# EAGLE design Smart ezNODE 503 M2 (EAGLE 7.7.0)
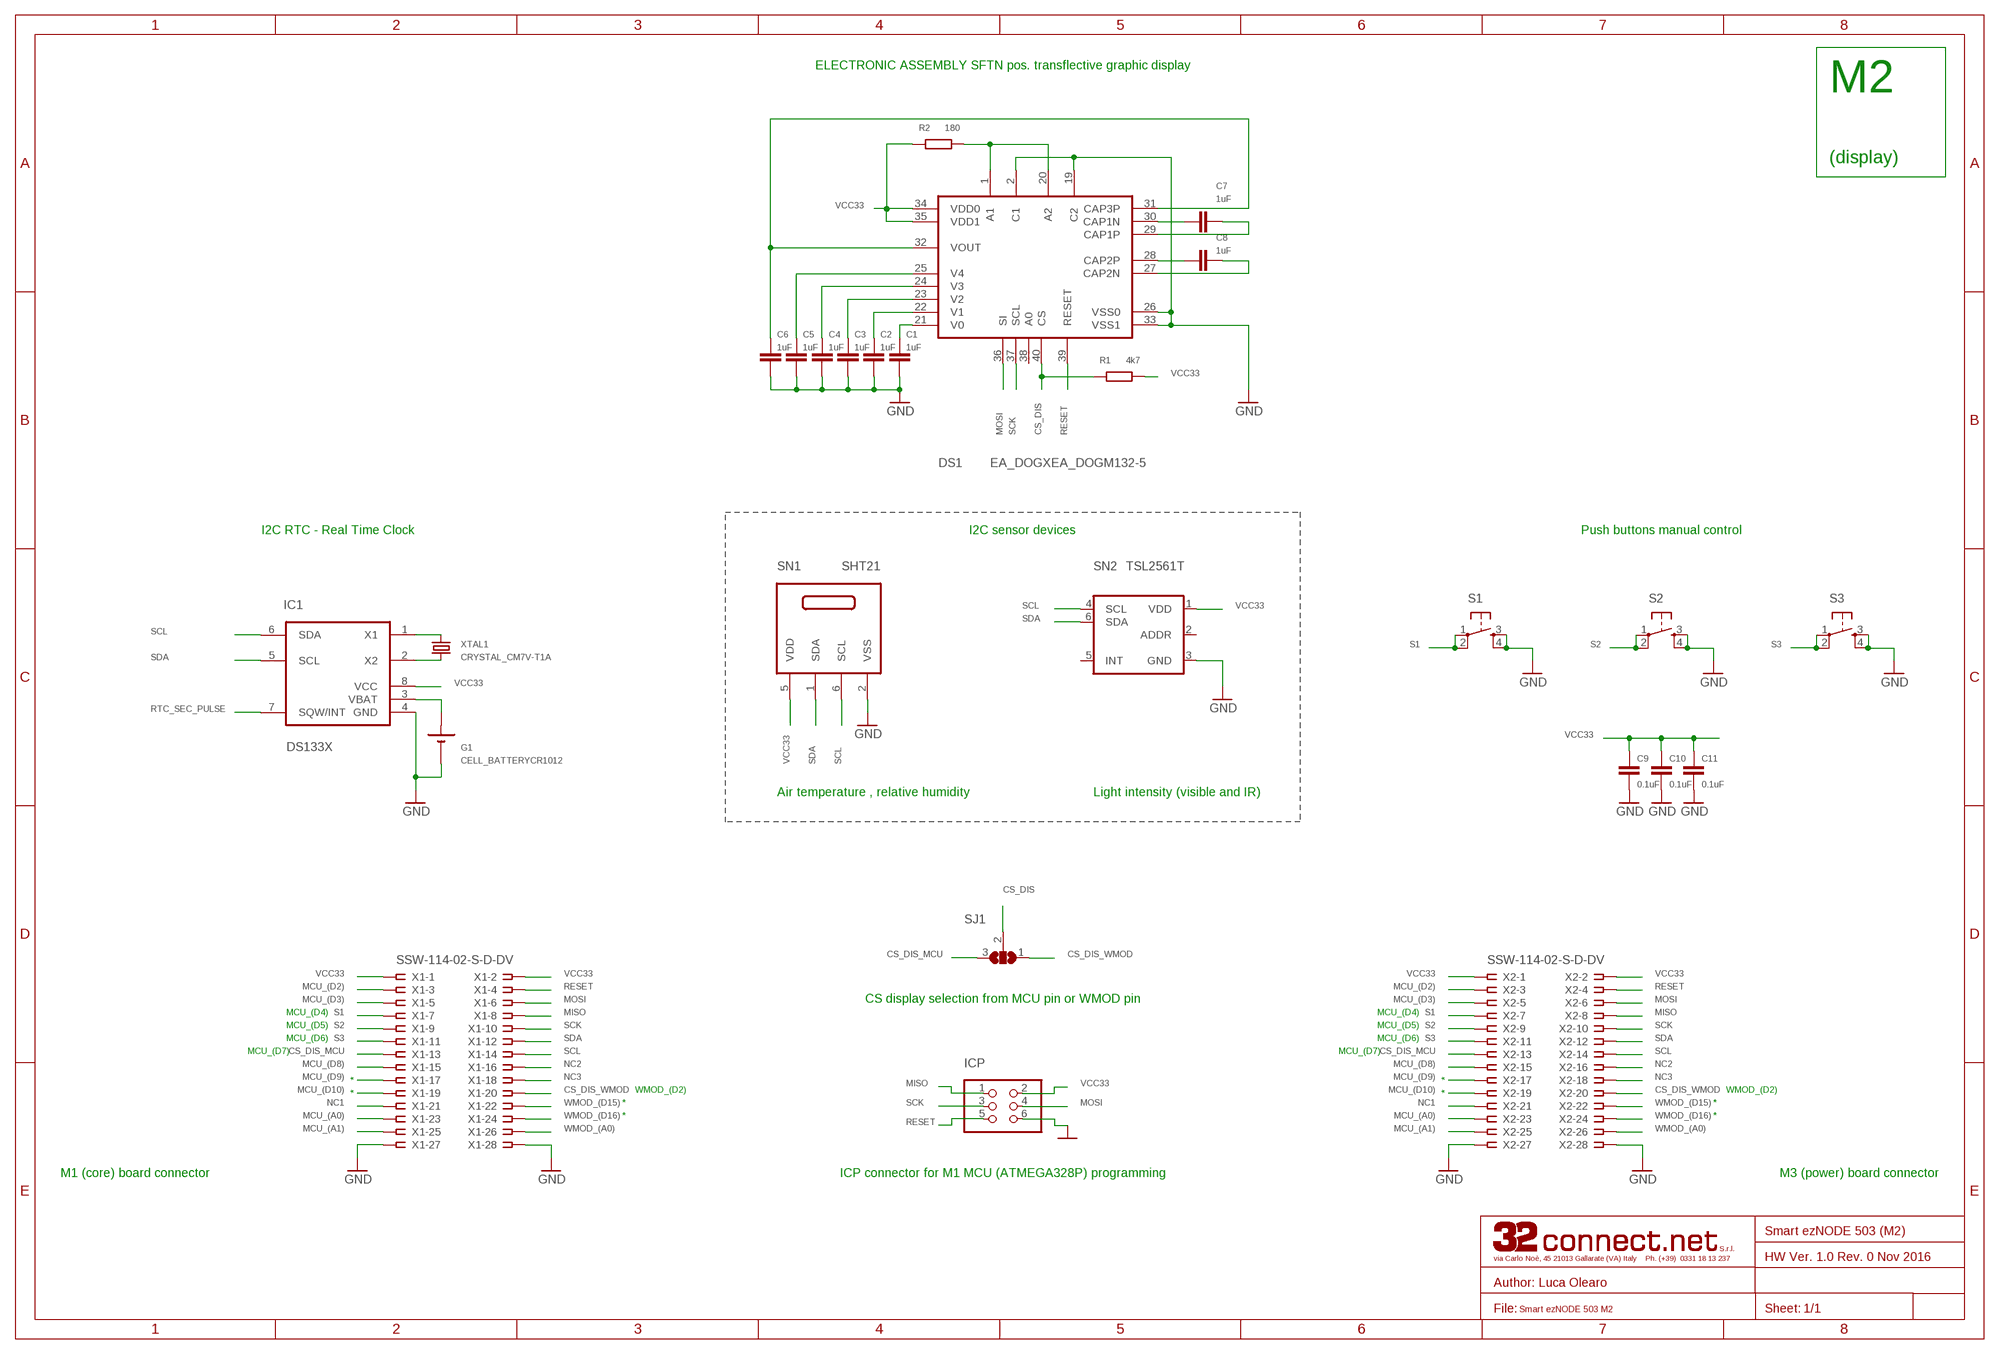
[diagram p0: schematic, sheet 1]

## Parts
C1  1uF  C-EUC0402  [C0402]
C2  1uF  C-EUC0402  [C0402]
C3  1uF  C-EUC0402  [C0402]
C4  1uF  C-EUC0402  [C0402]
C5  1uF  C-EUC0402  [C0402]
C6  1uF  C-EUC0402  [C0402]
C7  1uF  C-EUC0402  [C0402]
C8  1uF  C-EUC0402  [C0402]
C9  0.1uF  C-EUC0402  [C0402]
C10  0.1uF  C-EUC0402  [C0402]
C11  0.1uF  C-EUC0402  [C0402]
DS1  EA_DOGXEA_DOGM132-5  [EA_DOGM]
G1  CELL_BATTERYCR1012  [12MM_SMD_COIN_CELL_BATTERY_HOLDER]
IC1  DS133X  [MICRO08]
ICP  PINHD-2X3/SMD  [2X3_SMD]
R1  4k7  R-EU_R0402  [R0402]
R2  180  R-EU_R0805  [R0805]
S1  TAC_SWITCH3  [C&KKSCX_BEND]
S2  TAC_SWITCH3  [C&KKSCX_BEND]
S3  TAC_SWITCH3  [C&KKSCX_BEND]
SJ1  SJ2W  [SJ_2]
SN1  SHT21  [DFN6/SHT]
SN2  TSL2561T  [TMB-6]
X1  SSW-114-02-S-D-DV  [CLE-114-01-X-DV-A]
X2  SSW-114-02-S-D-DV  [CLE-114-01-X-DV-A]
XTAL1  CRYSTAL_CM7V-T1A  [CRYSTAL_CM7V-T1A]

## Nets
CS_DIS: DS1.40(CS) R1.1 SJ1.2
CS_DIS_MCU: SJ1.3 X1.13 X2.13
CS_DIS_WMOD: SJ1.1 X1.20 X2.20
GND: C1.2 C2.2 C3.2 C4.2 C5.2 C6.2 C9.2 C10.2 C11.2 DS1.2(C1) DS1.19(C2) DS1.26(VSS0) DS1.33(VSS1) G1.P$2(-) IC1.4(GND) ICP.6 S1.3 S1.4 S2.3 S2.4 S3.3 S3.4 SN1.2(VSS) SN2.3(GND) X1.27 X1.28 X2.27 X2.28
MCU_(A0): X1.23 X2.23
MCU_(A1): X1.25 X2.25
MCU_(D2): X1.3 X2.3
MCU_(D3): X1.5 X2.5
MCU_(D8): X1.15 X2.15
MCU_(D9): X1.17 X2.17
MCU_(D10): X1.19 X2.19
MISO: ICP.1 X1.8 X2.8
MOSI: DS1.36(SI) ICP.4 X1.6 X2.6
N$2: IC1.1(X1) XTAL1.P$2
N$3: IC1.2(X2) XTAL1.P$1
N$5: DS1.1(A1) DS1.20(A2) R2.1
N$8: C1.1 DS1.21(V0)
N$9: C7.1 DS1.30(CAP1N)
N$10: C2.1 DS1.22(V1)
N$11: C3.1 DS1.23(V2)
N$12: C4.1 DS1.24(V3)
N$13: C5.1 DS1.25(V4)
N$14: C6.1 DS1.31(CAP3P) DS1.32(VOUT)
N$15: C7.2 DS1.29(CAP1P)
N$16: C8.1 DS1.28(CAP2P)
N$17: C8.2 DS1.27(CAP2N)
N$18: G1.P$1(+) IC1.3(VBAT)
NC1: X1.21 X2.21
NC2: X1.16 X2.16
NC3: X1.18 X2.18
RESET: DS1.39(RESET) ICP.5 X1.4 X2.4
RTC_SEC_PULSE: IC1.7(SQW/INT)
S1: S1.1 S1.2 X1.7 X2.7
S2: S2.1 S2.2 X1.9 X2.9
S3: S3.1 S3.2 X1.11 X2.11
SCK: DS1.37(SCL) ICP.3 X1.10 X2.10
SCL: IC1.5(SCL) SN1.6(SCL) SN2.4(SCL) X1.14 X2.14
SDA: IC1.6(SDA) SN1.1(SDA) SN2.6(SDA) X1.12 X2.12
VCC33 [VCC1]: C9.1 C10.1 C11.1 DS1.34(VDD0) DS1.35(VDD1) IC1.8(VCC) ICP.2 R1.2 R2.2 SN1.5(VDD) SN2.1(VDD) X1.1 X1.2 X2.1 X2.2
WMOD_(A0): X1.26 X2.26
WMOD_(D15): X1.22 X2.22
WMOD_(D16): X1.24 X2.24
Unconnected: DS1.38(A0) SN2.2(ADDR) SN2.5(INT)

## Notes on the sheet
- ELECTRONIC ASSEMBLY SFTN pos. transflective graphic display
- M2
- (display)
- I2C RTC - Real Time Clock | I2C sensor devices | Push buttons manual control
- Air temperature , relative humidity | Light intensity (visible and IR)
- CS display selection from MCU pin or WMOD pin
- MCU_(D4) | MCU_(D4)
- MCU_(D5) | MCU_(D5)
- MCU_(D6) | MCU_(D6)
- MCU_(D7) | MCU_(D7)
- * | *
- * | WMOD_(D2) | * | WMOD_(D2)
- * | *
- * | *
- M1 (core) board connector | ICP connector for M1 MCU (ATMEGA328P) programming | M3 (power) board connector
- Smart ezNODE 503 (M2)
- HW Ver. 1.0 Rev. 0 Nov 2016

## Library data of the parts
C1-C11 = rcl:C-EU: CAPACITOR, European symbol
DS1 = ea:EA_DOGX
G1 = Multiconnect_base:CELL_BATTERY: CELL BATTERY
IC1 = Multiconnect_base:DS133X
ICP = Multiconnect_base:PINHD-2X3: PIN HEADER
R1 R2 = rcl:R-EU_: RESISTOR, European symbol
S1-S3 = Multiconnect_base:TAC_SWITCH: Momentary Switch
SJ1 = Multiconnect_base:SJ2W: SMD solder JUMPER
SN1 = sensirion:SHT21: Humidity and Temperature Sensor
SN2 = Multiconnect_base:TSL2561: TSL2561 illumination sensor Approximates Human Eye Response Precisely Measures Illuminance Programmable Interrupt Function with User-Defined Upper and Lower Threshold 400 KHz I2C interface Programmable Analog Gain and Integration Time Supporting 1,000,000-to-1 Dynamic Range Automatically Rejects 50/60-Hz Lighting Ripple Low Active Power (0.75 mW Typical) with Power Down Mode RoHS Compliant The TSL2561 is a light-to-digital converter that transform light intensity to a digital signal output via I2C interface. The device combines one broadband photodiode (visible plus infrared) and one infrared-responding photodiode on a single CMOS integrated circuit capable of providing a near-photopic response over an effective 20-bit dynamic range (16-bit resolution). Two integrating ADCs convert the photodiode currents to a digital output that represents the irradiance measured on each channel. This digital output can be input to a microprocessor where illuminance (ambient light level) in lux is derived using an empirical formula to approximate the human eye response. The TSL2561 device supports a traditional level style interrupt that remains asserted until the firmware clears it.
X1 X2 = con-samtec:SSW-114-02-S-D: THROUGH-HOLE .025" SQ POST SOCKET Source: Samtec SSW.pdf
XTAL1 = Multiconnect_base:CRYSTAL_CM7V-T1A

## Net classes
0 default: width 0.203 mm, clearance 0.152 mm
1 VCC1: width 0.254 mm, clearance 0.152 mm

## Board
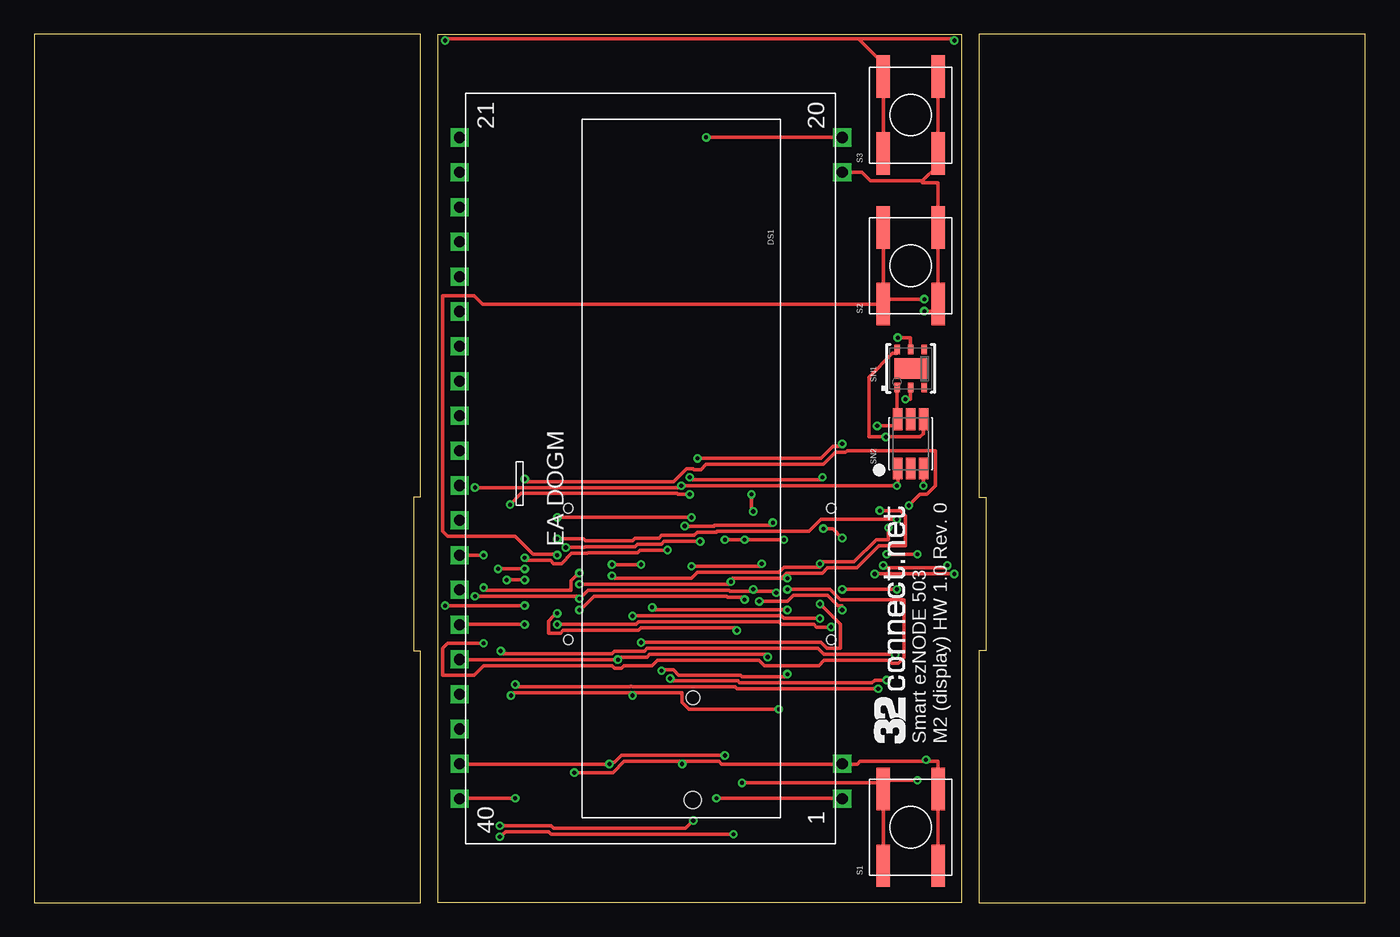
[diagram p1: board, top side]
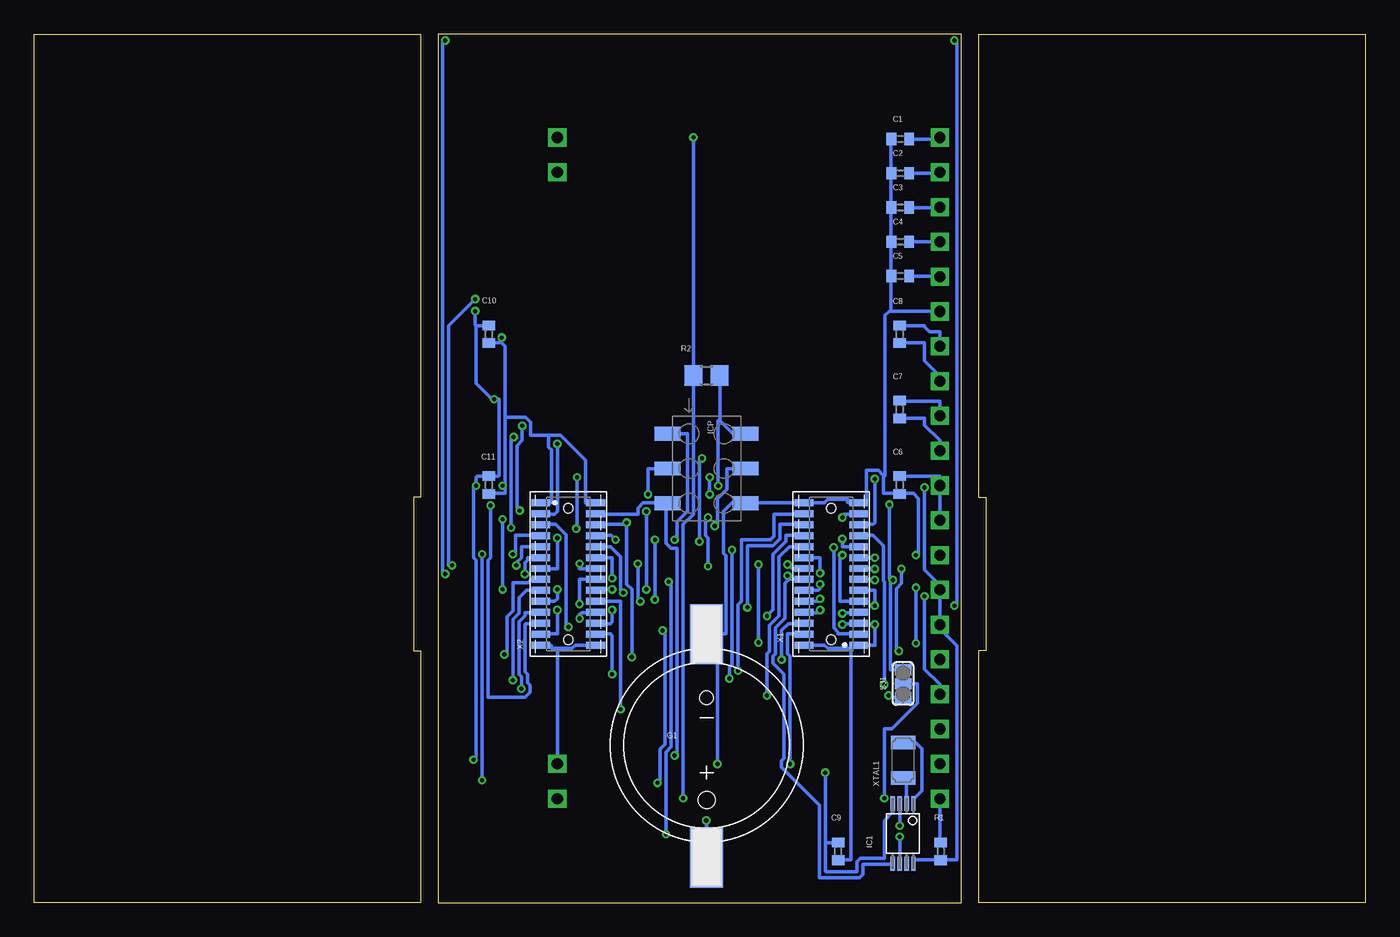
[diagram p2: board, bottom side, seen from below]

Size 97.2 x 63.4 mm. Coordinates in mm from the lower left corner, seen from the top.
Outline: 28.2,0 28.2,18.4 27.7,18.4 27.7,29.6 28.2,29.6 28.2,63.4 0,63.4 0,0 28.2,0
Outline: 67.7,0 29.5,0 29.5,63.4 67.7,63.4 67.7,0
Outline: 97.2,0 97.2,63.4 69,63.4 69,29.6 69.5,29.6 69.5,18.4 69,18.4 69,0 97.2,0
Copper layers (1*16): Top 0.035mm / dielectric 1.5mm / Bottom 0.035mm
Design rules "default *": minimum track width 10mil, minimum drill 12mil, track to track 6mil, track to pad 8mil, pad to pad 6mil, via to via 6mil, smd to smd 6mil, copper to edge 6mil, drill to drill 8mil, minimum pad ring 10mil, minimum via ring 6mil, stop-mask expansion 4mil, vias tented up to drill 0mil, thermal gap 10mil
tKeepout: area 0,62.2 to 13.2,63.4; area 0,0 to 13.2,1.2; area 29.5,0 to 67.7,1.2; area 29.5,62.2 to 67.7,63.4; area 84,62.2 to 97.2,63.4; area 84,0 to 97.2,1.2
bKeepout: area 0,62.2 to 13.2,63.4; area 0,0 to 13.2,1.2; area 29.5,0 to 67.7,1.2; area 29.5,62.2 to 67.7,63.4; area 84,62.2 to 97.2,63.4; area 84,0 to 97.2,1.2

### Footprints (pad centres in the part's own frame; a part is rotated, then mirrored left to right if it is on the bottom)
C0402 = smd 0.7 x 0.9: 1 -0.65,0; 2 0.65,0
EA_DOGM = drill 0.813 square: 1 0,0; 2 2.54,0; 19 45.72,0; 20 48.26,0; 21 48.26,27.94; 22 45.72,27.94; 23 43.18,27.94; 24 40.64,27.94; 25 38.1,27.94; 26 35.56,27.94; 27 33.02,27.94; 28 30.48,27.94; 29 27.94,27.94; 30 25.4,27.94; 31 22.86,27.94; 32 20.32,27.94; 33 17.78,27.94; 34 15.24,27.94; 35 12.7,27.94; 36 10.16,27.94; 37 7.62,27.94; 38 5.08,27.94; 39 2.54,27.94; 40 0,27.94
12MM_SMD_COIN_CELL_BATTERY_HOLDER = smd 2.4 x 4.4: P$1 0,-8.2; P$2 0,8.1 | hole 1.25: 0,-4 | hole 1: 0,3.45
MICRO08 = smd 1.04 x 0.32: 1 -2.25,0.75; 2 -2.25,0.25; 3 -2.25,-0.25; 4 -2.25,-0.75; 5 2.15,-0.75; 6 2.15,-0.25; 7 2.15,0.25; 8 2.15,0.75
2X3_SMD = smd 1.02 x 1.9: 1 -2.54,-2.85; 2 -2.54,2.85; 3 0,-2.85; 4 0,2.85; 5 2.54,-2.85; 6 2.54,2.85
R0402 = smd 0.7 x 0.9: 1 -0.65,0; 2 0.65,0
R0805 = smd 1.3 x 1.5: 1 -0.95,0; 2 0.95,0
C&KKSCX_BEND = smd 3.1 x 1: 1 -2.8,2; 2 2.8,2; 3 -2.8,-2; 4 2.8,-2
SJ_2 = smd 0.8 x 1.2: 1 -1.024,0; 2 0,0; 3 1.024,0
DFN6/SHT = smd 0.4 x 0.7: 1 -1,-1.4; 2 0,-1.4; 3 1,-1.4; 4 1,1.4; 5 0,1.4; 6 -1,1.4 | smd 2.4 x 1.5: NC 0,0
TMB-6 = smd 1.6 x 0.7: 1 -1.8,0.95; 2 -1.8,0; 3 -1.8,-0.95; 4 1.8,-0.95; 5 1.8,0; 6 1.8,0.95
CLE-114-01-X-DV-A = smd 0.508 x 1.372: 1 5.2,2; 2 5.2,-2; 3 4.4,2; 4 4.4,-2; 5 3.6,2; 6 3.6,-2; 7 2.8,2; 8 2.8,-2; 9 2,2; 10 2,-2; 11 1.2,2; 12 1.2,-2; 13 0.4,2; 14 0.4,-2; 15 -0.4,2; 16 -0.4,-2; 17 -1.2,2; 18 -1.2,-2; 19 -2,2; 20 -2,-2; 21 -2.8,2; 22 -2.8,-2; 23 -3.6,2; 24 -3.6,-2; 25 -4.4,2; 26 -4.4,-2; 27 -5.2,2; 28 -5.2,-2 | hole 0.686: -4.8,0; 4.8,0
CRYSTAL_CM7V-T1A = smd 1 x 1.8: P$1 -1.4,0; P$2 1.2,0

### Placement (x,y rotation side)
C1  33.95,55.75 180 bottom
C2  33.95,53.25 180 bottom
C3  33.95,50.75 180 bottom
C4  33.95,48.25 180 bottom
C5  33.95,45.75 180 bottom
C6  34,30.5 270 bottom
C7  34,36 90 bottom
C8  34,41.5 90 bottom
C9  38.5,3.75 90 bottom
C10  64,41.5 90 bottom
C11  64,30.5 90 bottom
DS1  59,7.6 90 top
G1  48.1,11.5 0 bottom
IC1  33.75,5 270 bottom
ICP  48.1,31.7 270 bottom
R1  31,3.75 270 bottom
R2  48.1,38.5 0 bottom
S1  64,5.5 90 top
S2  64,46.5 90 top
S3  64,57.5 90 top
SJ1  33.75,16 90 bottom
SN1  64,39 0 top
SN2  64,33.5 90 top
X1  39,24 270 bottom
X2  58.2,24 90 bottom
XTAL1  33.75,10.5 90 bottom

### Tracks (layer width: path | path; a pad name or v marks a point on that pad's centre or on a via)
CS_DIS  (via drill 0.3)
  Top 0.254: v35.12,7.62 31.06,7.62 DS1.40
  Bottom 0.254: R1.1 31,4.38 31.06,4.38 31.06,7.56 DS1.40 | SJ1.2 32.69,16 32.69,14.56 34.56,12.69 35.12,12.69 v35.12,7.62
CS_DIS_MCU  (via drill 0.3)
  Top 0.254: v35.81,23.56 v34.5,23.56 | v59,26.62 58.31,27.31 v57.62,27.31 | v57.56,31.06 57.56,30.88 48.06,30.88 v47.88,31.06 | v47.88,29.81 47,29.81 46.94,29.88 35.56,29.88 v34.75,29.06
  Bottom 0.254: v35.81,23.56 35.88,23.62 37,23.62 X1.13 | SJ1.3 33.75,17 34.69,17 34.69,23.38 v34.5,23.56 34.69,23.5 34.69,23.62 34.75,23.69 v34.75,29.06 | v59,26.62 59,24.38 60.19,24.38 X2.13 | v57.62,27.31 57.56,27.38 v57.56,31.06 | v47.88,29.81 v47.88,31.06
CS_DIS_WMOD  (via drill 0.3)
  Top 0.254: v34.81,15.12 35,15.31 43.5,15.31 v43.69,15.12 43.62,15.31 47.31,15.31 47.31,14.62 47.81,14.12 v54.38,14.12
  Bottom 0.254: v34.81,15.12 34.81,15 33.75,15 SJ1.1 | v43.69,15.12 43.69,18.19 43.5,18.38 43.5,20.25 42.81,20.94 42.81,25.25 42.06,26 X1.20 | X2.20 54.38,22 v54.38,14.12
GND  (via drill 0.3)
  Top 0.254: v32.81,25.38 DS1.33 | SN1.2 64,36.75 v63.62,36.75 | v64.94,30.44 64.94,31.69 SN2.3 | 64.88,52.69 61.06,52.69 60.44,53.31 DS1.19 | 64.88,52.69 66,53.81 S3.3 S3.4 | 64.88,52.69 64.88,52.56 66,52.56 S2.4 S2.3 66,43.25 65.94,43.19 v65,43.19 | S1.3 S1.4 66,10.31 65.12,10.31 | v39.44,9.5 42.25,9.5 43.06,10.31 47.31,10.31 | 47.31,10.31 50,10.31 50.19,10.12 59,10.12 DS1.2 59.12,10.12 60.12,10.12 60.31,10.31 65.12,10.31 | v65.12,10.44 65.12,10.31 | v47.31,10.12 47.31,10.31
  Bottom 0.254: C1.2 34.62,55.75 34.62,53.38 C2.2 34.62,53.25 34.62,50.75 C3.2 34.62,50.62 34.62,48.38 C4.2 34.62,48.25 34.62,45.75 C5.2 34.62,45.62 34.62,43.19 | 34.62,43.19 31.06,43.19 DS1.26 | 35.19,31.19 35.19,29.88 34,29.88 C6.2 33.88,29.88 33,29.88 32.62,29.5 32.62,25.38 v32.81,25.38 | 35.19,31.19 35.56,31.56 36.44,31.56 36.44,29.25 36.5,29.19 37,29.19 X1.27 37.12,29.19 37.75,29.19 37.81,29.25 37.81,29.44 39.25,29.44 39.5,29.19 40.88,29.19 X1.28 41,29.19 45.25,29.19 ICP.6 45.38,29.19 46.25,29.19 46.88,28.56 46.88,25.5 46.69,25.31 46.69,19.62 48.06,19.62 G1.P$2 47.31,19.5 v47.31,10.12 | 34.62,43.19 34.75,43.19 35.06,42.88 35.06,31.19 35.19,31.19 | 64.94,42.12 64,42.12 C10.2 | 64.94,42.12 64.94,37.94 63.75,36.75 v63.62,36.75 63.25,36.75 63.25,31.19 63.31,31.12 64,31.12 C11.2 64.12,31.12 64.88,31.12 64.94,31.06 v64.94,30.44 65.06,30.44 65.12,30.38 65.12,25.19 64.94,25 64.94,10.62 v65.12,10.44 | v65,43.19 65,42.19 64.94,42.12 | 39.44,4.38 38.5,4.38 C9.2 | 39.44,4.38 39.44,2.31 39.38,2.25 37.12,2.25 37.12,3 36.88,3.25 35.12,3.25 35.12,6 34.5,6.62 IC1.4 | 59,18.56 59.44,18.56 59.44,18.75 59.5,18.81 60.19,18.81 X2.27 | 59,18.56 57.94,18.56 57.69,18.81 56.25,18.81 X2.28 | 59,18.56 DS1.2 | v39.44,9.5 39.44,4.38
MCU_(A0)  (via drill 0.3)
  Top 0.254: v63.88,29 64.69,29.81 65.19,29.81 65.81,30.44 65.81,33 59.38,33 59.25,32.88 58.5,32.88 57.62,32 49.06,32 48.69,31.62 48.19,31.62 48.12,31.69 47.62,31.69 46.69,30.75 36,30.75 v35.81,30.94
  Bottom 0.254: v63.88,29 63.88,25.19 64.06,25 64.06,15 61.38,15 61,15.38 61,15.88 61.19,16.06 61.19,16.69 61.38,16.88 61.38,20.31 61.31,20.38 60.25,20.38 X2.23 | v35.81,30.94 35.81,27.75 35.94,27.62 37,27.62 X1.23
MCU_(A1)  (via drill 0.3)
  Top 0.254: v59,21.38 59,21.69 58.69,21.69 57.94,22.44 55.44,22.44 55,22 v52.94,22 | v53.12,24.75 53.12,24.56 v48,24.56 | v38.19,28.12 v48,28.12
  Bottom 0.254: v59,21.38 59,19.62 60.19,19.62 X2.25 | v52.94,22 53.12,22 v53.12,24.75 | v48,24.56 48,26.62 48.19,26.81 48.19,28 48.06,28.12 v48,28.12 | v38.19,28.12 38.19,28.25 38.06,28.38 37,28.38 X1.25
MCU_(D2)  (via drill 0.3)
  Top 0.254: v38.81,25.94 40.19,25.94 40.25,26 43.88,26 44.06,26.19 45.81,26.19 46,26.38 v48.62,26.38 | v48.44,32.44 57.44,32.44 58.31,33.31 58.81,33.31 v59,33.5
  Bottom 0.254: v38.81,25.94 38.81,20.06 38.5,19.75 38.5,19.62 37,19.62 X1.3 | v48.62,26.38 48.62,32.25 v48.44,32.44 | v59,33.5 59,28.56 59.19,28.38 60.19,28.38 X2.3
MCU_(D3)  (via drill 0.3)
  Top 0.254: v38.19,20.31 43.94,20.31 44.12,20.5 54.38,20.5 54.56,20.31 56.94,20.31 57.12,20.12 v58.19,20.12
  Bottom 0.254: v38.19,20.31 38.19,20.38 37,20.38 X1.5 | v58.19,20.12 58.38,20.31 58.38,26.88 59.12,27.62 60.19,27.62 X2.5
MCU_(D8)  (via drill 0.3)
  Top 0.254: v62.88,18.12 57.69,18.12 57.25,18.56 44.75,18.56 44.56,18.38 42.38,18.38 42.19,18.19 34.25,18.19 v34.06,18.38 | v35.81,24.38 v33.88,24.38
  Bottom 0.254: v62.88,18.12 62.69,18.31 62.69,20.88 62.25,21.31 62.25,23.38 61.12,23.38 60.88,23.62 60.25,23.62 X2.15 | v34.06,18.38 34.25,18.38 34.25,22.94 33.88,23.31 v33.88,24.38 | v35.81,24.38 37,24.38 X1.15
MCU_(D9)  (via drill 0.3)
  Top 0.254: v35.81,25.19 36,25 37.69,25 37.94,24.75 38.5,24.75 39.25,25.5 40.38,25.5 40.44,25.56 44.06,25.56 44.25,25.75 v46.25,25.75 | v46.44,16.38 46.44,16.19 51.38,16.19 51.5,16.06 61.19,16.06 61.38,16.25 v62.25,16.25
  Bottom 0.254: v35.81,25.19 37,25.19 X1.17 | v46.25,25.75 46.25,17.38 46.44,17.19 v46.44,16.38 | v62.25,16.25 62.25,20.69 61.81,21.12 61.81,22.25 61.25,22.81 60.25,22.81 X2.17
MCU_(D10)  (via drill 0.3)
  Top 0.254: v38.19,26.56 40.12,26.56 40.25,26.44 43.69,26.44 43.88,26.62 45.62,26.62 45.81,26.81 48.19,26.81 48.44,27.06 49.81,27.06 49.88,27.12 56.56,27.12 57.44,28 v63,28 | v59,22.88 v63,22.88
  Bottom 0.254: X1.19 38.19,26 v38.19,26.56 | v63,22.88 v63,28 | v59,22.88 59,22.19 59.19,22 X2.19
MISO  (via drill 0.3)
  Top 0.254: v39.81,21.38 40,21.56 40.06,21.56 40.88,22.38 50.56,22.38 50.62,22.31 51.69,22.31 v51.88,22.12 | v54.75,26.5 v51.88,26.5 v50.44,26.5
  Bottom 0.254: v39.81,21.38 39.81,21.19 41,21.19 X1.8 | v51.88,26.5 v51.88,22.12 | v54.75,26.5 55.06,26.81 56.19,26.81 X2.8 | v50.44,26.5 50.25,26.69 50.25,27.81 49.5,28.56 49.5,34.25 50.94,34.25 ICP.1
MOSI  (via drill 0.3)
  Top 0.254: DS1.36 v42.62,17.75 42.5,17.88 42.56,17.94 44.75,17.94 44.94,18.12 53.56,18.12 v53.56,17.94 | v47.5,27.5 49.62,27.5 49.69,27.56 53.75,27.56 v53.94,27.75
  Bottom 0.254: v42.62,17.75 42.62,19.88 42.12,20.38 41,20.38 X1.6 | 53.94,27.62 56.19,27.62 X2.6 | 53.94,27.62 53.94,23.25 53.56,22.88 v53.56,17.94 | v47.5,27.5 47.31,27.69 47.31,29.5 46.62,30.19 46.62,31.69 45.25,31.69 ICP.4 | v53.94,27.75 53.94,27.62
N$2
  Bottom 0.254: IC1.1 33,7.56 32.38,8.19 32.38,11.25 32.81,11.69 33.75,11.69 XTAL1.P$2
N$3
  Bottom 0.254: IC1.2 33.5,9.06 33.56,9.12 33.75,9.12 XTAL1.P$1
N$5  (via drill 0.3)
  Top 0.254: v49.81,7.62 59,7.62 DS1.1 | v49.06,55.88 59,55.88 DS1.20
  Bottom 0.254: v49.81,7.62 49.81,27.62 49.06,28.38 49.06,38.5 R2.1 49.06,38.62 v49.06,55.88
N$8
  Bottom 0.254: C1.1 31.06,55.75 31.06,55.81 DS1.21
N$9
  Bottom 0.254: C7.1 34,35.38 32.19,35.38 32.19,34.88 31.06,33.75 DS1.30
N$10
  Bottom 0.254: C2.1 31.06,53.25 DS1.22
N$11
  Bottom 0.254: C3.1 31.06,50.75 DS1.23
N$12
  Bottom 0.254: C4.1 DS1.24
N$13
  Bottom 0.254: C5.1 31.06,45.75 DS1.25
N$14
  Bottom 0.254: C6.1 34,31.12 31.06,31.12 31.06,30.5 DS1.31 31.06,30.38 31.06,27.94 DS1.32
N$15
  Bottom 0.254: C7.2 34,36.62 31.06,36.62 31.06,35.56 DS1.29
N$16
  Bottom 0.254: C8.1 34,40.88 32.19,40.88 32.19,39.56 31.06,38.44 31.06,38.12 DS1.28
N$17
  Bottom 0.254: C8.2 34,42.12 32.19,42.12 32.19,42.06 31.81,41.69 31.06,41.69 DS1.27
N$18  (via drill 0.3)
  Top 0.254: v34,5.62 37.75,5.62 37.94,5.44 47.56,5.44 v48.12,6
  Bottom 0.254: v34,5.62 IC1.3 | v48.12,6 48.12,3.31 G1.P$1
NC1  (via drill 0.3)
  Top 0.254: v61.62,15.62 51.31,15.62 51.19,15.75 43.69,15.75 43.62,15.81 43.56,15.81 43.5,15.75 35.31,15.75 v35.12,15.94
  Bottom 0.254: v61.62,15.62 61.62,16.5 61.81,16.69 61.81,20.5 61.38,20.94 61.38,21.19 60.25,21.19 X2.21 | v35.12,15.94 35.12,23.44 35.19,23.5 35.19,26.06 35.94,26.81 37,26.81 X1.21
NC2  (via drill 0.3)
  Top 0.254: v57.38,21.81 58.88,20.31 58.88,18.56 57.88,18.56 57.44,19 v44.31,19 | v42.19,24.69 v44.31,24.69
  Bottom 0.254: v57.38,21.81 57.38,23.62 56.25,23.62 X2.16 | v44.31,24.69 v44.31,19 | v42.19,24.69 41.94,24.69 41.94,24.5 41.81,24.38 41,24.38 X1.16
NC3  (via drill 0.3)
  Top 0.254: v39.81,24.06 39.62,23.88 39.56,23.88 39.19,23.5 39.19,22.81 33,22.81 v32.81,23 | v32.81,18.94 30.19,18.94 29.81,18.56 29.81,16.62 32.12,16.62 32.81,17.31 42.19,17.31 42.38,17.12 42.88,17.12 43.06,17.31 45.12,17.31 45.5,17.69 52.94,17.69 53.31,17.31 57.31,17.31 57.69,17.69 62.44,17.69 62.62,17.5 63.12,17.5 63.5,17.88 63.5,22.12 58.88,22.12 58.12,22.88 v55,22.88
  Bottom 0.254: v39.81,24.06 39.81,25.19 41,25.19 X1.18 | v32.81,18.94 v32.81,23 | v55,22.88 55.5,22.88 55.56,22.81 56.19,22.81 X2.18
RESET  (via drill 0.3)
  Top 0.254: DS1.39 31.06,10.12 v42,10.12 42,10.25 42.38,10.25 42.88,10.75 v50.44,10.75
  Bottom 0.254: X2.4 56.19,28.38 53.12,28.38 53.12,28.81 52.75,29.19 51,29.19 ICP.5 51.06,29.06 51.06,26.25 50.69,25.88 50.25,25.88 50.25,10.94 v50.44,10.75 | v42,10.12 42,18 42.19,18.19 42.19,19.62 41,19.62 X1.4
S1  (via drill 0.3)
  Top 0.254: v38.19,21.12 38,20.94 37.94,20.94 37.56,20.56 37.56,19.69 38.44,19.69 38.62,19.88 44.12,19.88 44.31,20.06 51.12,20.06 v51.31,19.88 | v51.69,8.75 61.94,8.75 62,8.69 S1.2 | v64.5,25.44 v62.25,25.44 | v64.5,8.94 62.06,8.94 62,8.88 61.94,8.88 S1.2 | S1.2 S1.1
  Bottom 0.254: v38.19,21.12 38.19,21.19 37,21.19 X1.7 | v51.31,19.88 51.12,19.88 51.12,11.56 51.5,11.19 51.5,8.94 v51.69,8.75 | v62.25,25.44 62.06,25.62 62.06,26.81 60.25,26.81 X2.7 | v64.5,8.94 v64.5,25.44
S2  (via drill 0.3)
  Top 0.254: v38.19,25.38 38.12,25.44 36.44,25.44 35.12,26.75 30.19,26.75 29.81,27.12 29.81,44.31 32.12,44.31 32.75,43.69 62,43.69 S2.1 | v62,24.62 62,24.44 66.5,24.44 v66.69,24.62 | v65,44.06 62.06,44.06 62,44 S2.1 | S2.2 62,44.19 62.06,44.19 S2.1
  Bottom 0.254: X1.9 38.38,22 38.38,25.19 v38.19,25.38 | X2.9 61.62,26 61.62,25.19 62,24.81 v62,24.62 | v66.69,24.62 66.94,24.62 66.94,42.12 v65,44.06
S3  (via drill 0.3)
  Top 0.254: v30,21.69 v35.81,21.69 | v30,62.94 30,63.06 60.19,63.06 | 60.19,63.06 62,61.25 S3.2 S3.1 | v67.19,24 v61.38,24 | v67.19,62.94 67.19,63.06 60.19,63.06
  Bottom 0.254: v35.81,21.69 35.81,22.81 37,22.81 X1.11 | v30,21.69 29.81,21.69 29.81,62.75 v30,62.94 | v61.38,24 61.38,24.81 61.19,25 61.19,25.19 60.25,25.19 X2.11 | v67.19,24 67.38,24 67.38,62.75 v67.19,62.94
SCK  (via drill 0.3)
  Top 0.254: 52.5,22.75 54.06,22.75 v54.19,22.62 | 52.5,22.75 50.81,22.75 50.75,22.81 40.44,22.81 v39.81,22.19 39.88,22.38 v32.19,22.38 | v52.38,29.81 52.38,28.56 v52.5,28.56 | v52.5,22.88 52.5,22.75
  Bottom 0.254: X1.10 39.81,22 v39.81,22.19 | v54.19,22.62 54.38,22.81 54.38,25.25 55.12,26 X2.10 | v52.38,29.81 52.38,31.69 51,31.69 ICP.3 | v52.5,22.88 v52.5,28.56 | v32.19,22.38 32.19,17.06 31.06,15.94 31.06,15.25 DS1.37
SCL  (via drill 0.3)
  Top 0.254: SN1.6 63,40.12 62.69,40.12 60.94,38.38 60.94,34 v62.19,34 64.69,34 64.94,34.25 64.94,35.25 SN2.4 | v42.19,23.88 42.38,23.69 48,23.69 48.44,24.12 54.38,24.12 54.75,24.5 57.38,24.5 v57.38,24.75 57.38,24.88 59.88,24.88 61.5,26.5 62.38,26.5 v62.38,27.38
  Bottom 0.254: 42.12,23.56 42.06,23.62 41,23.62 X1.14 | 42.12,23.56 42.38,23.31 42.38,20.75 43.06,20.06 43.06,18.19 43.25,18 43.25,17.5 42.44,16.69 42.44,10.56 42.62,10.38 42.62,9.88 39.88,7.12 39.88,1.81 36.94,1.81 36.69,2.06 36.69,2.81 34.5,2.81 IC1.5 | v57.38,24.75 57.38,24.38 56.25,24.38 X2.14 | v42.19,23.88 42.19,23.62 42.12,23.56 | v62.19,34 62.38,34 v62.38,27.38
SDA  (via drill 0.3)
  Top 0.254: SN1.1 63,36 63.06,35.94 63.06,35.31 SN2.6 63.06,35.19 63.06,34.81 v61.56,34.81 | v34,4.81 34.19,5 34.25,5 34.44,5.19 37.56,5.19 37.75,5 v51.06,5 | v39.81,23.25 50.69,23.25 v50.88,23.44 50.88,23.56 51,23.69 54.69,23.69 | 54.69,23.69 v55,23.69 | v61.75,28.62 63.25,28.62 63.62,28.25 63.62,26.06 61.69,26.06 60.06,24.44 57.94,24.44 57.56,24.06 54.94,24.06 54.69,23.81 54.69,23.69
  Bottom 0.254: v34,4.81 IC1.6 | v51.06,5 51.06,11 50.69,11.38 50.69,23.25 v50.88,23.44 | v39.81,23.25 39.81,22.94 39.94,22.81 41,22.81 X1.12 | v55,23.69 55,25.19 56.19,25.19 X2.12 | v61.56,34.81 61.56,33.75 61.94,33.38 61.94,28.81 v61.75,28.62
VCC33  (via drill 0.3)
  Top 0.254: SN1.5 64,41.25 v63.06,41.25 | SN2.1 63.06,31.69 63.06,30.44 v63,30.44 v47.25,30.44 47.25,30.31 v32.19,30.31 | v35.81,20.31 31.06,20.31 DS1.35
  Bottom 0.254: 59.62,34.12 58.75,34.12 56.94,32.31 56.94,29.19 56.25,29.19 X2.2 | 59.62,34.12 59.62,33.25 59.44,33.06 59.44,29.25 59.5,29.19 60.19,29.19 X2.1 | 47.12,35.19 47.12,38.5 R2.2 | 47.12,35.19 46.19,34.25 ICP.2 | v63.06,41.25 63.19,41.12 63.19,40.94 | 63.19,40.94 63.25,40.88 64,40.88 C10.1 | 62.81,35.44 62.81,40.62 63.06,40.88 63.06,40.94 63.19,40.94 | 62.81,35.44 62.81,30.44 | 62.81,30.44 62.81,29.88 64,29.88 C11.1 | v63,30.44 62.81,30.44 | v47.25,30.44 47.25,35.19 47.12,35.19 | 59.62,34.12 60.94,34.12 60.94,35.06 61.31,35.44 62.81,35.44 | 37.56,18.56 37.56,18.75 37.5,18.81 37,18.81 X1.1 36.88,18.81 35.81,18.81 v35.81,20.31 | 37.56,18.56 37.56,3.12 38.5,3.12 C9.1 | 37.56,18.56 39.25,18.56 39.5,18.81 41,18.81 X1.2 | IC1.8 33,3.12 31,3.12 R1.2 30.88,3.12 29.81,3.12 29.81,18.75 31.06,20 31.06,20.25 DS1.35 31.06,20.38 31.06,22.81 DS1.34 31.06,22.94 31.06,23.19 32.19,24.31 v32.19,30.31
WMOD_(A0)  (via drill 0.3)
  Top 0.254: v45.81,16.94 45.88,17 46.69,17 47.06,16.62 51.56,16.62 51.69,16.5 54.81,16.5 v55,16.69
  Bottom 0.254: v45.81,16.94 45.81,21.75 45.56,22 45.56,26.5 43.44,26.5 43.19,26.75 43.19,28.38 41,28.38 X1.26 | v55,16.69 55,19.5 55.12,19.62 56.19,19.62 X2.26
WMOD_(D15)  (via drill 0.3)
  Top 0.254: v43.69,20.94 54.56,20.94 54.75,20.75 v57.38,20.75
  Bottom 0.254: v43.69,20.94 43.25,21.38 43.25,25.44 42.31,26.38 42.31,26.81 41,26.81 X1.22 | v57.38,20.75 57.38,21.06 57.25,21.19 56.25,21.19 X2.22
WMOD_(D16)  (via drill 0.3)
  Top 0.254: v45.12,21.56 45.12,21.38 v55,21.38
  Bottom 0.254: v45.12,21.56 45.12,26.06 43.25,26.06 42.75,26.56 42.75,27.62 41,27.62 X1.24 | v55,21.38 55,20.5 55.12,20.38 56.19,20.38 X2.24

### Text on the board
tNames: Smart ezNODE 503 / M2 (display) HW 1.0 Rev. 0